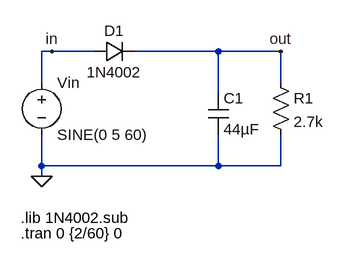
[diagram p0: schematic PreLab4.asc]
PreLab4.asc, the LTspice schematic file:
Version 4
SHEET 1 880 680
WIRE 160 80 144 80
WIRE 224 80 160 80
WIRE 416 80 288 80
WIRE 512 80 416 80
WIRE 144 128 144 80
WIRE 512 128 512 80
WIRE 416 144 416 80
WIRE 144 256 144 208
WIRE 416 256 416 208
WIRE 416 256 144 256
WIRE 512 256 512 208
WIRE 512 256 416 256
WIRE 144 272 144 256
FLAG 144 272 0
FLAG 512 80 out
FLAG 160 80 in
SYMBOL voltage 144 112 R0
WINDOW 123 0 0 Left 0
WINDOW 39 0 0 Left 0
SYMATTR InstName Vin
SYMATTR Value SINE(0 5 60)
SYMBOL diode 224 96 R270
WINDOW 0 32 32 VTop 2
WINDOW 3 0 32 VBottom 2
SYMATTR InstName D1
SYMATTR Value 1N4002
SYMBOL res 496 112 R0
SYMATTR InstName R1
SYMATTR Value 2.7k
SYMBOL cap 400 144 R0
SYMATTR InstName C1
SYMATTR Value 44µF
TEXT 112 360 Left 2 !.tran 0 {2/60} 0
TEXT 112 336 Left 2 !.lib 1N4002.sub

The netlist it stands for:
* PreLab4.asc
Vin in 0 SINE(0 5 60)
D1 in out 1N4002
R1 out 0 2.7k
C1 out 0 44µF
.model D D
.lib standard.dio
.tran 0 {2/60} 0
.lib 1N4002.sub
.backanno
.end

* Results of the author's LTspice run, read from the files saved beside the schematic
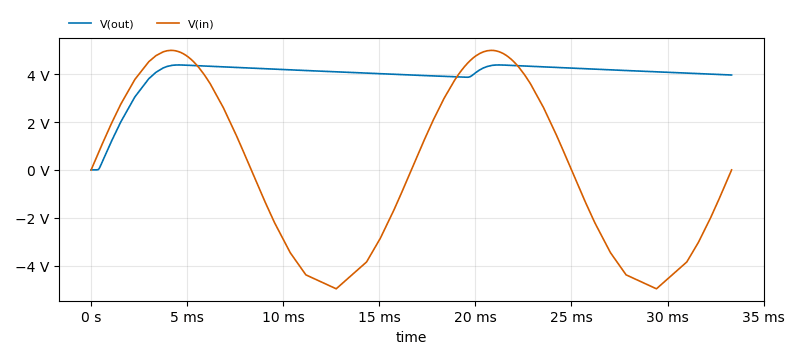
[diagram p1: Transient Analysis of PreLab4.asc, plotted from the saved traces]
* Transient Analysis, 1 run:
*   V(out): min 0 V, max 4.39 V, average 3.948 V, rms 4.024 V, last 3.969 V
*   V(in): min -4.973 V, max 5 V, average 27.62 mV, rms 3.509 V, last 0 V